# Altium schematic sheet Studio Lighting Driver.SchDoc: Studio Lighting Driver
size A4; SheetNumber: 1; SheetTotal: 6
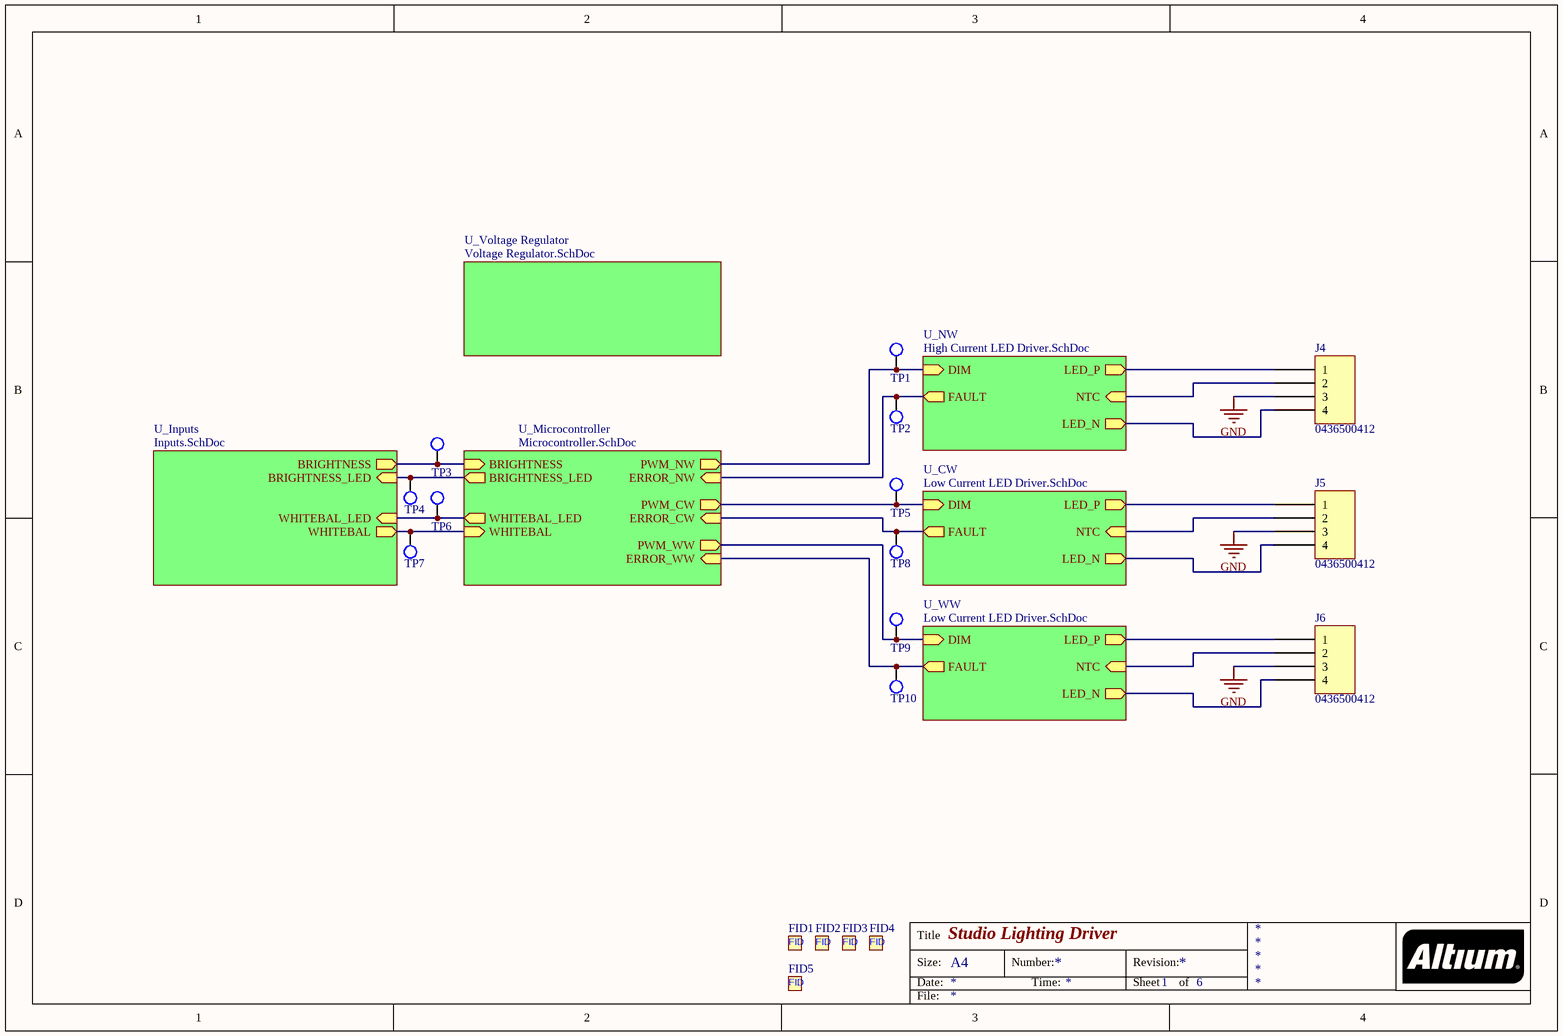
[diagram p0: Studio Lighting Driver.SchDoc]

## Parts
FID1  Fiducial  [Fiducial-1mm]  (value not drawn)
FID2  Fiducial  [Fiducial-1mm]  (value not drawn)
FID3  Fiducial  [Fiducial-1mm]  (value not drawn)
FID4  Fiducial  [Fiducial-1mm]  (value not drawn)
FID5  Fiducial  [Fiducial-1mm]  (value not drawn)
J4  0436500412  [MOLEX 436500412]
J5  0436500412  [MOLEX 436500412]
J6  0436500412  [MOLEX 436500412]
TP1  Test Point  [TestPoint-1.5mm]  (value not drawn)  (no BOM)
TP2  Test Point  [TestPoint-1.5mm]  (value not drawn)  (no BOM)
TP3  Test Point  [TestPoint-1.5mm]  (value not drawn)  (no BOM)
TP4  Test Point  [TestPoint-1.5mm]  (value not drawn)  (no BOM)
TP5  Test Point  [TestPoint-1.5mm]  (value not drawn)  (no BOM)
TP6  Test Point  [TestPoint-1.5mm]  (value not drawn)  (no BOM)
TP7  Test Point  [TestPoint-1.5mm]  (value not drawn)  (no BOM)
TP8  Test Point  [TestPoint-1.5mm]  (value not drawn)  (no BOM)
TP9  Test Point  [TestPoint-1.5mm]  (value not drawn)  (no BOM)
TP10  Test Point  [TestPoint-1.5mm]  (value not drawn)  (no BOM)

## Sub-sheets
U_CW = Low Current LED Driver.SchDoc: LED_P (out), LED_N (out), DIM (in), NTC (in), FAULT (out)
U_Inputs = Inputs.SchDoc: BRIGHTNESS (out), BRIGHTNESS_LED (in), WHITEBAL (out), WHITEBAL_LED (in)
U_Microcontroller = Microcontroller.SchDoc: BRIGHTNESS (in), WHITEBAL (in), PWM_CW (out), PWM_WW (out), PWM_NW (out), ERROR_NW (in), ERROR_WW (in), ERROR_CW (in), BRIGHTNESS_LED (out), WHITEBAL_LED (out)
U_NW = High Current LED Driver.SchDoc: LED_P (out), LED_N (out), DIM (in), NTC (in), FAULT (out)
U_Voltage Regulator = Voltage Regulator.SchDoc: no entries
U_WW = Low Current LED Driver.SchDoc: LED_P (out), LED_N (out), DIM (in), NTC (in), FAULT (out)

## Nets
GND: J4.3 J5.3 J6.3
NetJ4_1: J4.1 ; sheet U_NW/LED_P
NetJ4_2: J4.2 ; sheet U_NW/NTC
NetJ4_4: J4.4 ; sheet U_NW/LED_N
NetJ5_1: J5.1 ; sheet U_CW/LED_P
NetJ5_2: J5.2 ; sheet U_CW/NTC
NetJ5_4: J5.4 ; sheet U_CW/LED_N
NetJ6_1: J6.1 ; sheet U_WW/LED_P
NetJ6_2: J6.2 ; sheet U_WW/NTC
NetJ6_4: J6.4 ; sheet U_WW/LED_N
NetTP1_1: TP1.1(TP) ; sheet U_NW/DIM, sheet U_Microcontroller/PWM_NW
NetTP2_1: TP2.1(TP) ; sheet U_NW/FAULT, sheet U_Microcontroller/ERROR_NW
NetTP3_1: TP3.1(TP) ; sheet U_Microcontroller/BRIGHTNESS, sheet U_Inputs/BRIGHTNESS
NetTP4_1: TP4.1(TP) ; sheet U_Microcontroller/BRIGHTNESS_LED, sheet U_Inputs/BRIGHTNESS_LED
NetTP5_1: TP5.1(TP) ; sheet U_CW/DIM, sheet U_Microcontroller/PWM_CW
NetTP6_1: TP6.1(TP) ; sheet U_Microcontroller/WHITEBAL_LED, sheet U_Inputs/WHITEBAL_LED
NetTP7_1: TP7.1(TP) ; sheet U_Microcontroller/WHITEBAL, sheet U_Inputs/WHITEBAL
NetTP8_1: TP8.1(TP) ; sheet U_CW/FAULT, sheet U_Microcontroller/ERROR_CW
NetTP9_1: TP9.1(TP) ; sheet U_WW/DIM, sheet U_Microcontroller/PWM_WW
NetTP10_1: TP10.1(TP) ; sheet U_WW/FAULT, sheet U_Microcontroller/ERROR_WW

## Notes on the sheet
- Title
- Size:
- Date:
- A4
- Number:
- Time:
- Revision:
- Sheet
- of
- File:
- (in symbol Fiducial) FID

## Library data of the parts
J4-J6 = 0436500412: CONN HEADER SMD R/A 4POS 3MM; Manufacturer: Molex; Material Flammability Rating: UL94 V-0; Number of Positions: 4; Number of Positions Loaded: All; Pitch - Mating: 0.118" (3.00mm); Shrouding: Shrouded - 4 Wall; Style: Board to Cable/Wire; Part Number: 0436500412; ComponentLink1Description: Datasheet; ComponentLink1URL: https://www.molex.com/pdm_docs/sd/436500412_sd.pdf; ComponentLink2Description: DigiKey Link; ComponentLink2URL: https://www.digikey.com/en/products/detail/molex/0436500412/3451041; Connector Type: Header; Contact Finish - Mating: Tin; Contact Finish - Post: Tin; Contact Finish Thickness - Mating: 60.0µin (1.52µm); Contact Material: Brass; Contact Shape: Square; Contact Type: Male Pin; Fastening Type: Locking Ramp; Features: Solder Retention; Insulation Color: Black; Insulation Height: 0.172" (4.37mm); Insulation Material: Liquid Crystal Polymer (LCP), Glass Filled; LastUpdated: 21/03/2022 20:35:03; Lifecycle Status: Active; Minimum Order: 1; Mounting Type: Surface Mount, Right Angle; Number of Rows: 1; Packaging: TapeAndReel; PartId: 134; Part Status: Active; Price: 1.64; Series: Micro-Fit 3.0 43650; Supplier 1: DigiKey; Supplier Part Number 1: WM1892CT-ND; Termination: Solder